# EAGLE design untitled (EAGLE 9.6.2)
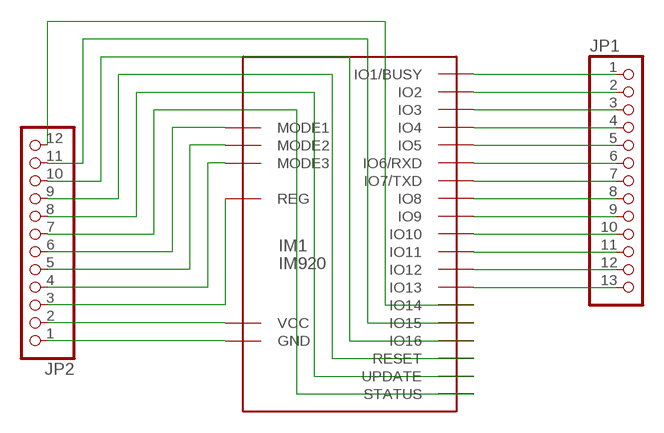
[diagram p0: schematic, sheet 1]

## Parts
IM1  IM920  [IM920]
JP1  PINHD-1X13  [1X13]
JP2  PINHD-1X12  [1X12]

## Nets
1PIN: IM1.IO25(RESET) JP2.9
N$1: IM1.IO1(IO1/BUSY) JP1.1
N$2: IM1.IO2 JP1.2
N$3: IM1.IO3 JP1.3
N$4: IM1.IO4 JP1.4
N$5: IM1.IO5 JP1.5
N$6: IM1.IO6(IO6/RXD) JP1.6
N$7: IM1.IO7(IO7/TXD) JP1.7
N$8: IM1.IO8 JP1.8
N$9: IM1.IO9 JP1.9
N$10: IM1.IO10 JP1.10
N$11: IM1.IO11 JP1.11
N$12: IM1.IO12 JP1.12
N$13: IM1.IO24(GND) JP2.1
N$14: IM1.IO23(VCC) JP2.2
N$15: IM1.IO22(REG) JP2.3
N$16: IM1.IO19(MODE3) JP2.4
N$17: IM1.IO18(MODE2) JP2.5
N$18: IM1.IO17(MODE1) JP2.6
N$19: IM1.IO21(STATUS) JP2.7
N$20: IM1.IO20(UPDATE) JP2.8
N$22: IM1.IO16 JP2.10
N$23: IM1.IO15 JP2.11
N$24: IM1.IO14 JP2.12
N$25: IM1.IO13 JP1.13

## Library data of the parts
IM1 = IM920:IM920
JP1 = pinhead:PINHD-1X13: PIN HEADER
JP2 = pinhead:PINHD-1X12: PIN HEADER

## Board
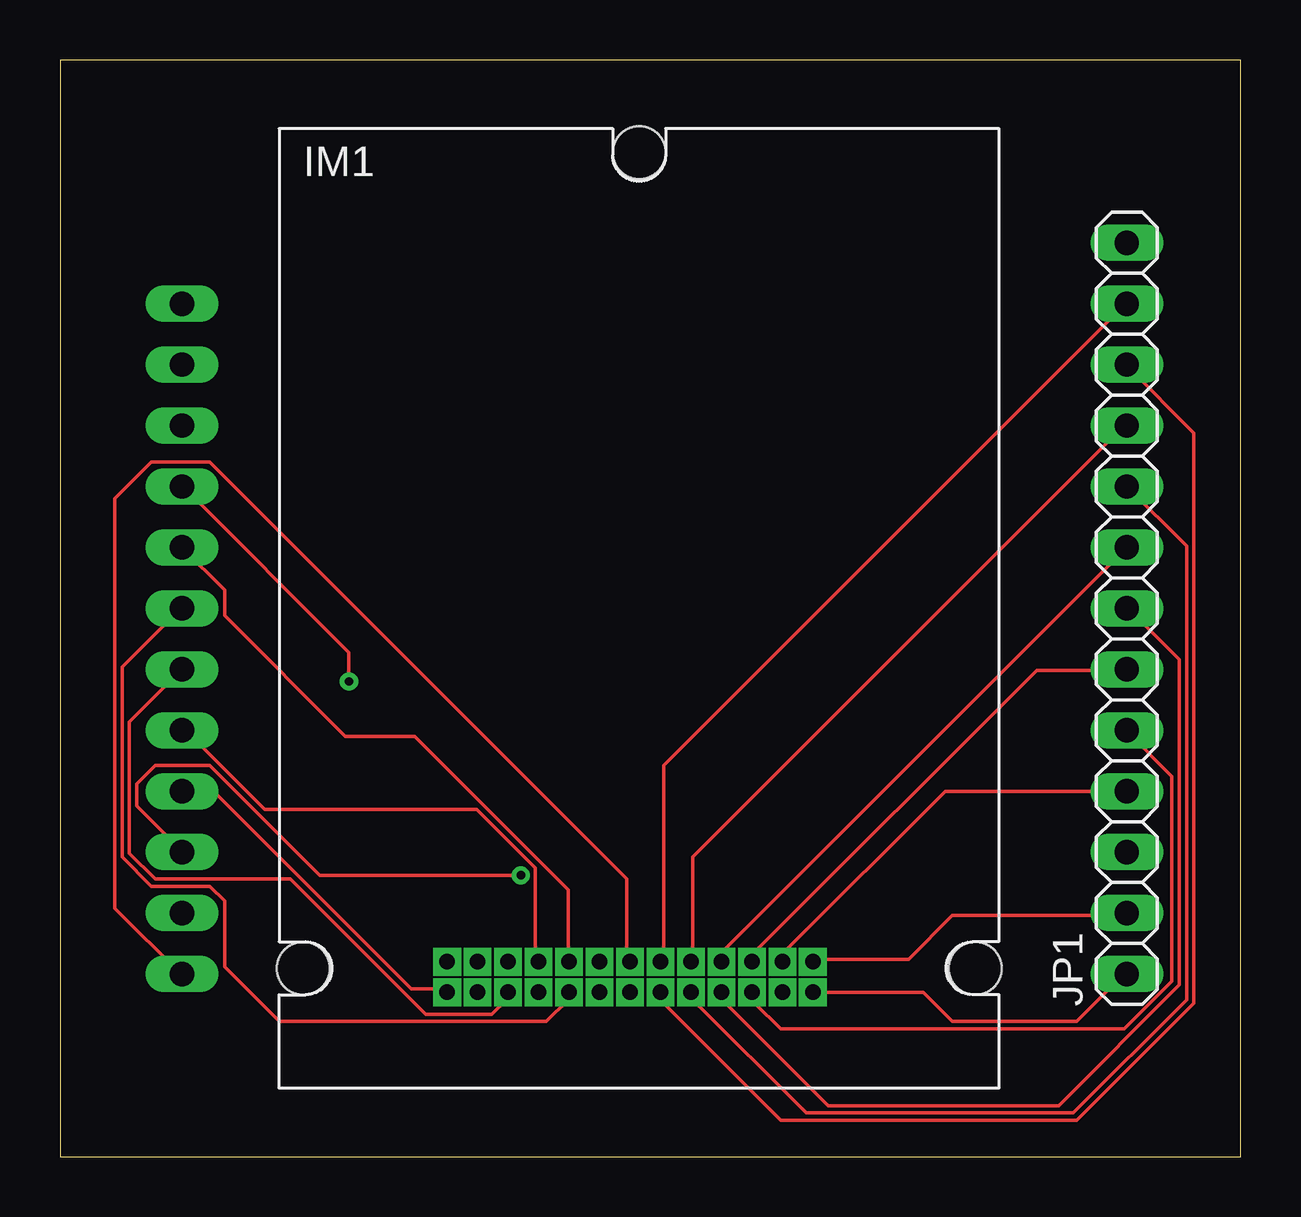
[diagram p1: board, top side]
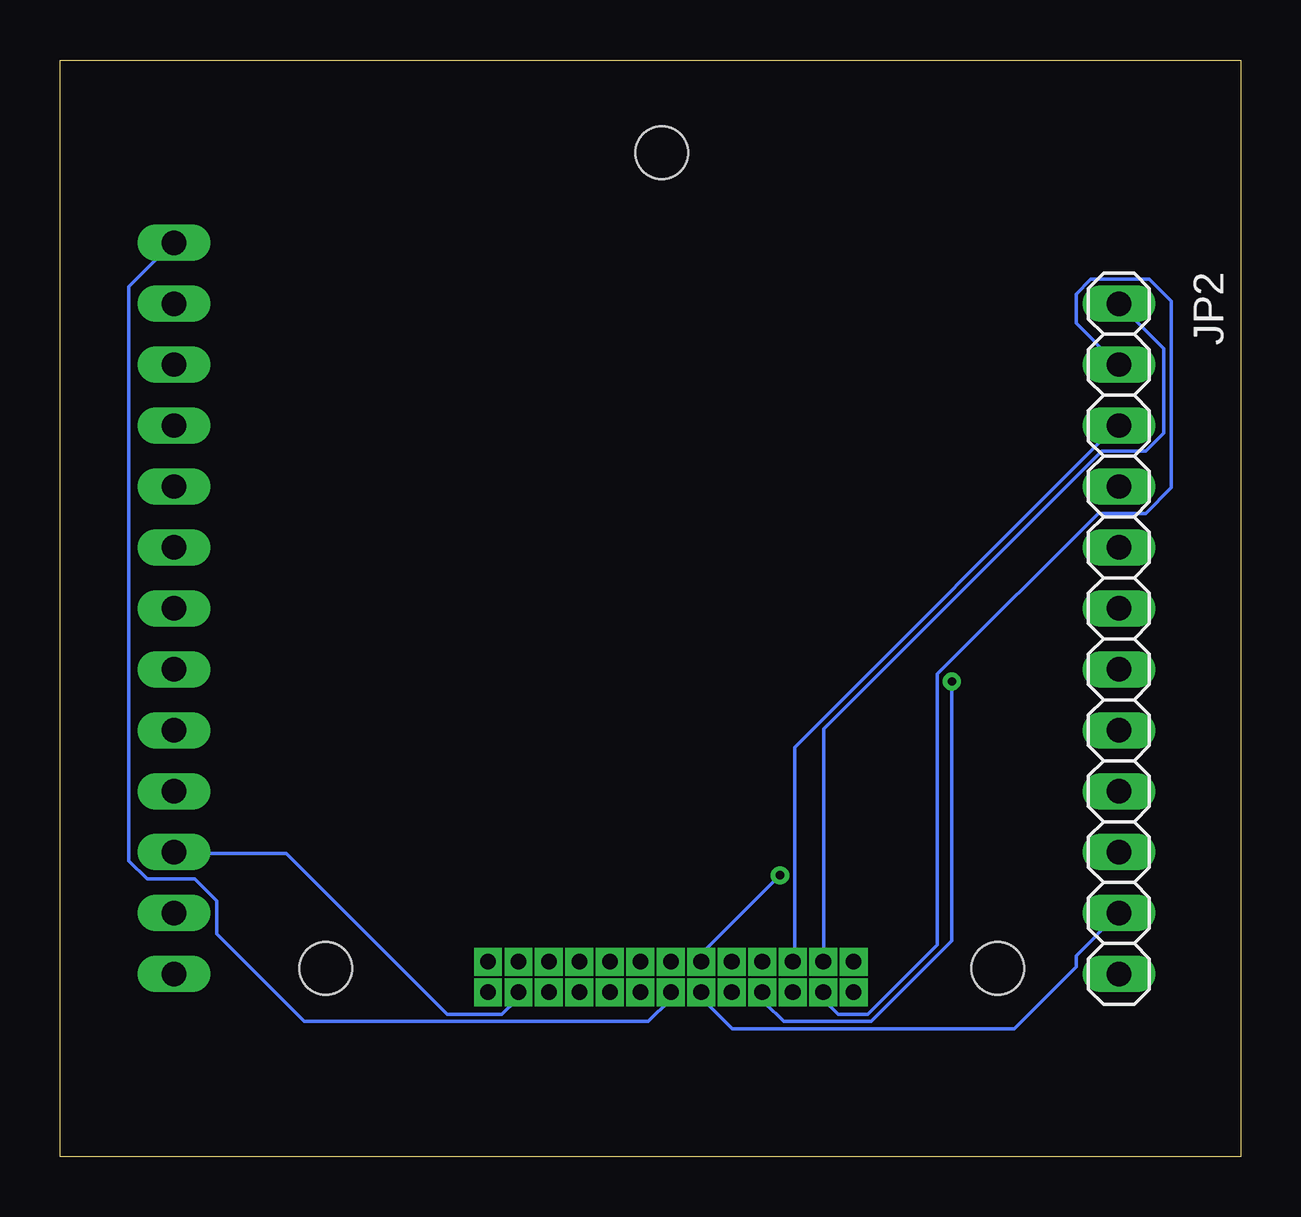
[diagram p2: board, bottom side, seen from below]

Size 49.2 x 45.72 mm. Coordinates in mm from the lower left corner, seen from the top.
Outline: 0,0 49.2,0 49.2,45.71 0.01,45.72 0,0
Copper layers (1*16): Top 0.035mm / dielectric 1.5mm / Bottom 0.035mm
Design rules "PCBGoGo": minimum track width 6mil, minimum drill 0.2mm, track to track 6mil, track to pad 6mil, pad to pad 6mil, via to via 6mil, smd to smd 6mil, copper to edge 0.2mm, drill to drill 6mil, minimum pad ring 10mil, minimum via ring 8mil, stop-mask expansion 4mil, vias tented up to drill 0mil, thermal gap 10mil

### Footprints (pad centres in the part's own frame; a part is rotated, then mirrored left to right if it is on the bottom)
IM920 = drill 0.65 square: IO1 7.24,-16; IO2 7.24,-14.73; IO3 5.97,-16; IO4 5.97,-14.73; IO5 4.7,-16; IO6 4.7,-14.73; IO7 3.43,-16; IO8 3.43,-14.73; IO9 2.16,-16; IO10 2.16,-14.73; IO11 0.89,-16; IO12 0.89,-14.73; IO13 -0.38,-16; IO14 -0.38,-14.73; IO15 -1.65,-16; IO16 -1.65,-14.73; IO17 -2.92,-16; IO18 -2.92,-14.73; IO19 -4.19,-16; IO20 -4.19,-14.73; IO21 -5.46,-16; IO22 -5.46,-14.73; IO23 -6.73,-16; IO24 -6.73,-14.73; IO25 -8,-16; IO26 -8,-14.73 | hole 2.2: -14,-15; 14,-15; 0,19
1X13 = drill 1.016 long: 1 -15.24,0; 2 -12.7,0; 3 -10.16,0; 4 -7.62,0; 5 -5.08,0; 6 -2.54,0; 7 0,0; 8 2.54,0; 9 5.08,0; 10 7.62,0; 11 10.16,0; 12 12.7,0; 13 15.24,0
1X12 = drill 1.016 long: 1 -13.97,0; 2 -11.43,0; 3 -8.89,0; 4 -6.35,0; 5 -3.81,0; 6 -1.27,0; 7 1.27,0; 8 3.81,0; 9 6.35,0; 10 8.89,0; 11 11.43,0; 12 13.97,0

### Placement (x,y rotation side)
IM1  24.13,22.86 0 top
JP1  44.45,22.86 90 top
JP2  5.08,21.59 270 bottom

### Tracks (layer width: path | path; a pad name or v marks a point on that pad's centre or on a via)
1PIN
  Top 0.152: JP2.9 6.4,15.24 14.63,7.01 16,7.01 IM1.IO25
N$1
  Top 0.152: IM1.IO1 31.39,6.86 35.97,6.86 37.19,5.64 42.37,5.64 44.35,7.62 JP1.1
N$2
  Top 0.152: IM1.IO2 31.39,8.23 35.36,8.23 37.19,10.06 44.35,10.06 JP1.2
N$3
  Bottom 0.152: IM1.IO3 30.18,6.86 30.18,6.55 30.79,5.94 33.07,5.94 39.78,12.65 44.35,12.65 JP1.3
N$4
  Top 0.152: JP1.4 36.88,15.24 30.18,8.53 30.18,8.23 IM1.IO4
N$5
  Top 0.152: IM1.IO5 28.96,6.86 28.96,6.4 30.02,5.33 44.35,5.33 46.33,7.32 46.33,15.85 44.5,17.68 JP1.5
N$6
  Top 0.152: IM1.IO6 28.96,8.23 28.96,8.53 40.69,20.27 44.35,20.27 JP1.6
N$7
  Top 0.152: IM1.IO7 27.58,6.86 27.58,6.55 32,2.13 41.6,2.13 46.63,7.16 46.63,20.73 44.5,22.86 JP1.7
N$8
  Top 0.152: JP1.8 27.58,8.53 27.58,8.23 IM1.IO8
N$9
  Top 0.152: JP1.9 46.94,25.45 46.94,6.55 42.22,1.83 31.09,1.83 26.36,6.55 26.36,6.86 IM1.IO9
N$10
  Top 0.152: IM1.IO10 26.36,8.23 26.36,12.5 44.35,30.48 JP1.10
N$11
  Top 0.152: IM1.IO11 25.15,6.86 25.15,6.4 30.02,1.52 42.37,1.52 47.24,6.4 47.24,30.18 44.5,32.92 JP1.11
N$12
  Top 0.152: IM1.IO12 25.15,8.23 25.15,16.31 44.35,35.51 JP1.12
N$13
  Bottom 0.152: JP2.1 3.2,33.68 3.2,30.18 3.96,29.41 5.79,29.41 17.37,17.83 17.37,8.23 IM1.IO24
N$14
  Bottom 0.152: IM1.IO23 17.37,6.86 17.37,6.55 16.76,5.94 15.54,5.94 12.65,8.84 12.65,20.12 5.94,26.82 3.96,26.82 2.9,27.89 2.9,35.66 3.81,36.58 6.25,36.58 6.86,35.97 6.86,34.75 5.18,33.07 JP2.2
N$15
  Bottom 0.152: IM1.IO22 18.59,8.23 18.59,17.07 5.18,30.48 JP2.3
N$16  (via drill 0.35)
  Top 0.152: v12.04,19.81 12.04,21.03 5.18,27.89 JP2.4
  Bottom 0.152: v12.04,19.81 12.04,8.99 15.39,5.64 19.05,5.64 19.81,6.4 19.81,6.86 IM1.IO19
N$17
  Top 0.152: JP2.5 6.86,23.62 6.86,22.55 11.89,17.53 14.78,17.53 21.18,11.12 21.18,8.23 IM1.IO18
N$18
  Top 0.152: IM1.IO17 21.18,6.86 21.18,6.55 20.27,5.64 9.14,5.64 6.86,7.92 6.86,10.67 6.25,11.28 3.81,11.28 2.59,12.5 2.59,20.42 5.03,22.86 JP2.6
N$19
  Top 0.152: JP2.7 2.9,18.14 2.9,12.65 3.96,11.58 9.6,11.58 15.24,5.94 17.98,5.94 18.59,6.55 18.59,6.86 IM1.IO21
N$20
  Top 0.152: IM1.IO20 19.81,8.23 19.81,12.04 17.37,14.48 8.53,14.48 5.18,17.83 JP2.8
N$22  (via drill 0.35)
  Top 0.152: v19.2,11.73 10.82,11.73 6.25,16.31 3.96,16.31 3.2,15.54 3.2,14.63 5.03,12.8 JP2.10
  Bottom 0.152: v19.2,11.73 22.4,8.53 22.4,8.23 IM1.IO16
N$23
  Bottom 0.152: JP2.11 6.86,8.38 6.86,7.92 9.45,5.33 21.18,5.33 22.4,6.55 22.4,6.86 IM1.IO15
N$24
  Top 0.152: IM1.IO14 23.62,8.23 23.62,11.58 6.25,28.96 3.81,28.96 2.29,27.43 2.29,10.36 5.03,7.62 JP2.12
N$25
  Bottom 0.152: IM1.IO13 23.77,6.86 23.77,6.55 24.69,5.64 39.01,5.64 42.67,9.3 42.67,10.67 43.59,11.58 45.57,11.58 46.33,12.34 46.33,36.27 44.5,38.1 JP1.13